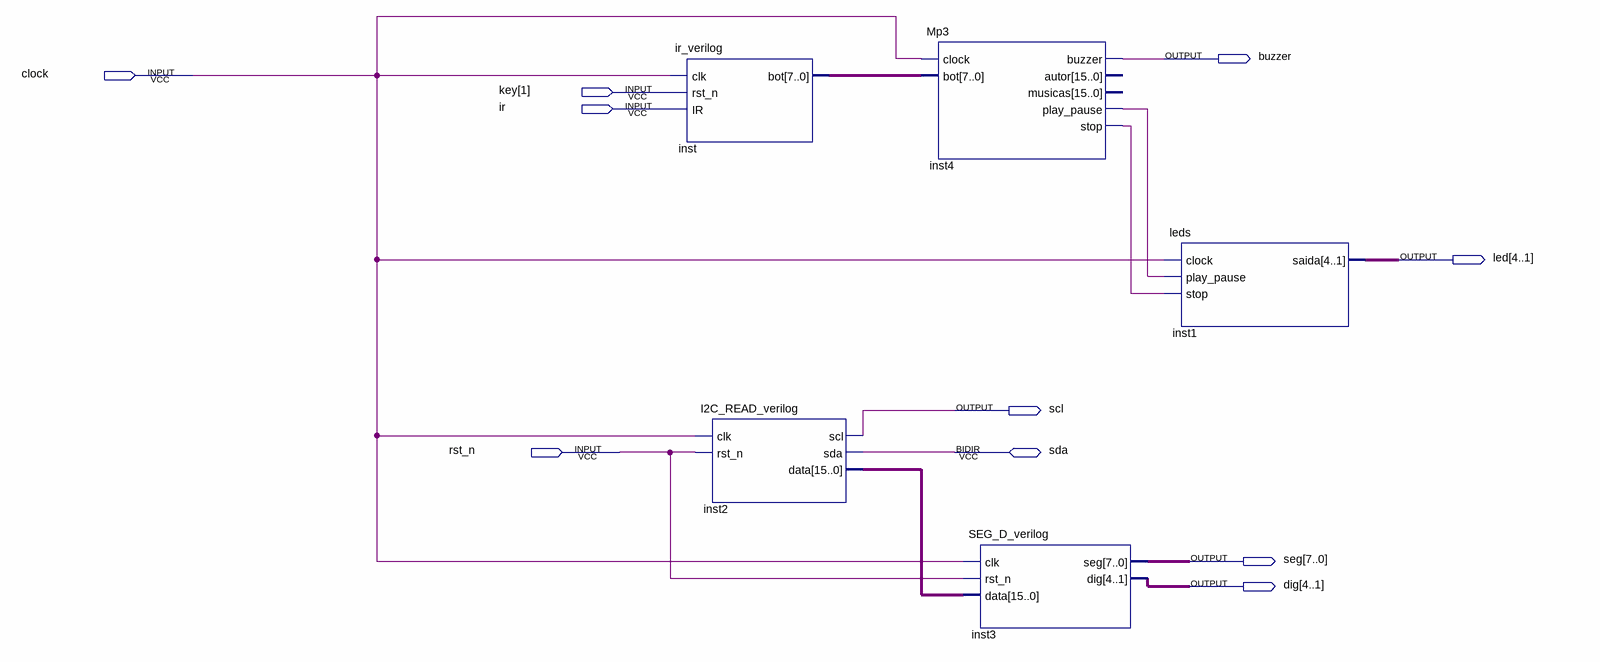
[diagram p0: schematic sheet]
// Quartus schematic top_entity.bdf as structural Verilog: 5 symbols, 10 pins
module top_entity (
  input  clock,
  input  [1:1] key,
  input  ir,
  input  rst_n,
  inout  sda,
  output buzzer,
  output [4:1] led,
  output scl,
  output [7:0] seg,
  output [4:1] dig
);

  wire inst4_play_pause, inst4_stop;
  wire [7:0] inst_bot;
  wire [15:0] inst2_data;

  ir_verilog inst (.clk(clock), .rst_n(key[1]), .IR(ir), .bot(inst_bot));
  I2C_READ_verilog inst2 (.clk(clock), .rst_n(rst_n), .scl(scl), .data(inst2_data), .sda(sda));
  Mp3 inst4 (
    .clock(clock), .bot(inst_bot), .buzzer(buzzer), .play_pause(inst4_play_pause), .stop(inst4_stop));  // open: autor, musicas
  SEG_D_verilog inst3 (.clk(clock), .rst_n(rst_n), .data(inst2_data), .seg(seg), .dig(dig));
  leds inst1 (.clock(clock), .play_pause(inst4_play_pause), .stop(inst4_stop), .saida(led));
endmodule
